# Altium project Hardware_Project.PrjPcb
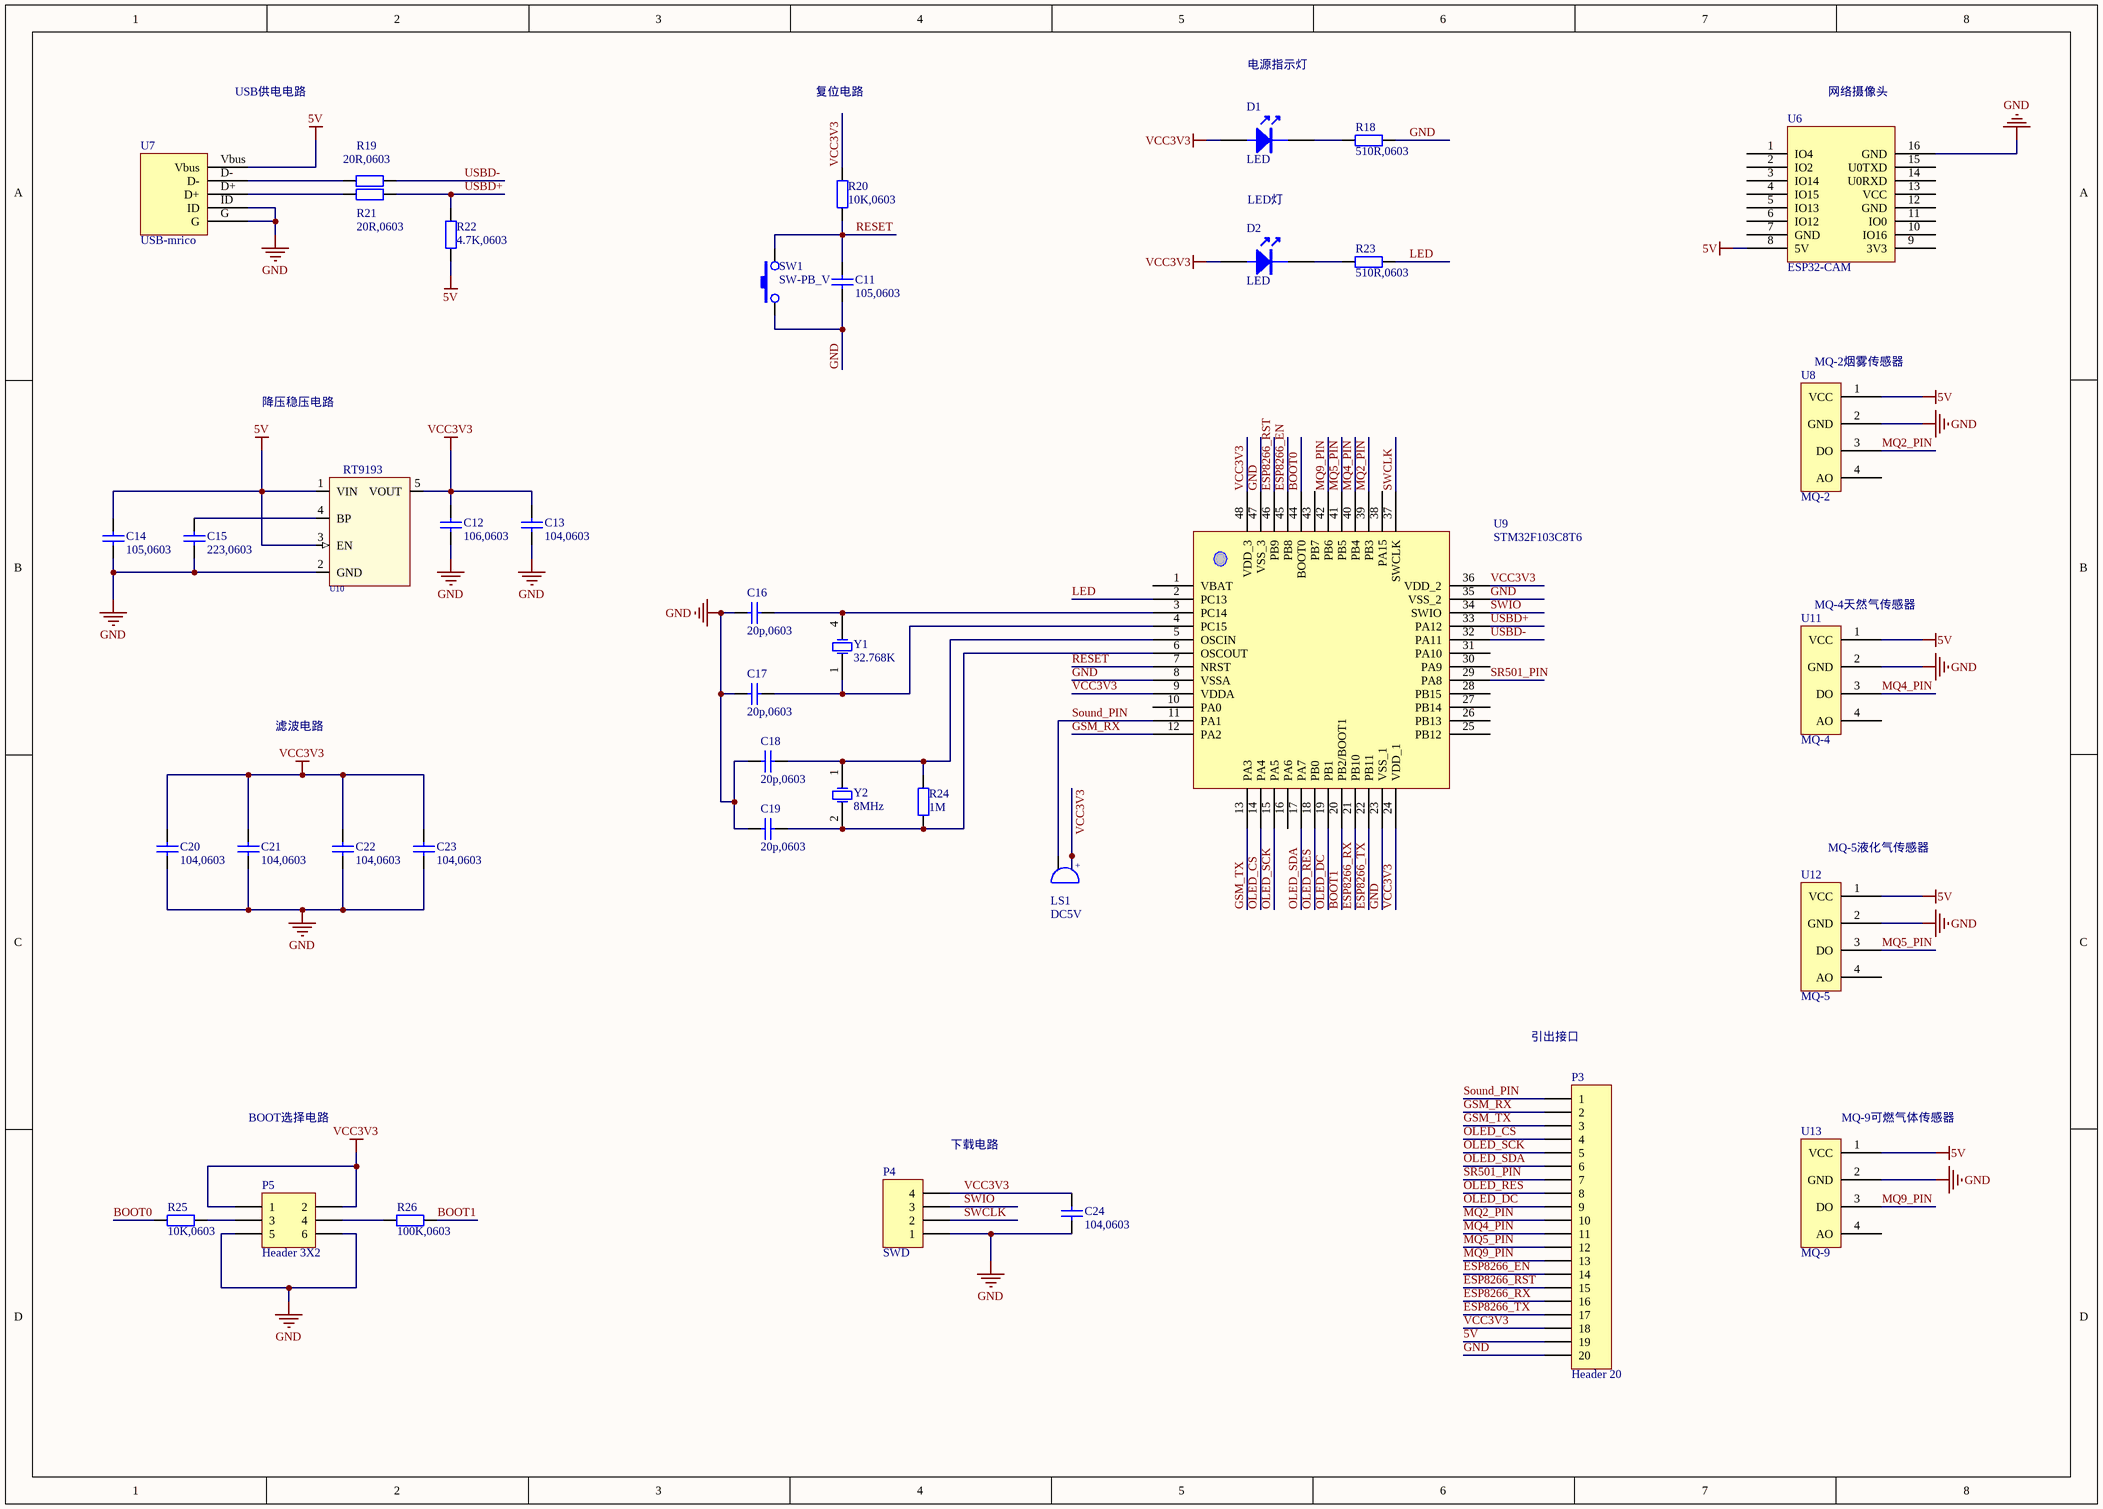
[diagram p0: STM32F103C8T6.SchDoc]
6 sheets, 149 parts. Net scope: global (net labels, ports and power ports of the same name join across sheets).
Sheets:
  STM32F103C8T6.SchDoc
  MQ.SchDoc
  SIM800A.SchDoc
  ESP-01S.SchDoc
  OLED.SchDoc
  HC-SR501.SchDoc

## Sheet STM32F103C8T6.SchDoc
size A3; SheetNumber: 1; SheetTotal: 6

### Parts
C11  105,0603  [C0603]
C12  106,0603  [C0603]
C13  104,0603  [C0603]
C14  105,0603  [C0603]
C15  223,0603  [C0603]
C16  20p,0603  [C0603]
C17  20p,0603  [C0603]
C18  20p,0603  [C0603]
C19  20p,0603  [C0603]
C20  104,0603  [C0603]
C21  104,0603  [C0603]
C22  104,0603  [C0603]
C23  104,0603  [C0603]
C24  104,0603  [C0603]
D1  LED  [LED]
D2  LED  [LED]
LS1  DC5V  [BEEP 5x9x5.5]
P3  Header 20  [HDR1X20]
P4  SWD  [HDR1X4]
P5  Header 3X2  [HDR2X3]
R18  510R,0603  [R0603]
R19  20R,0603  [R0603]
R20  10K,0603  [R0603]
R21  20R,0603  [R0603]
R22  4.7K,0603  [R0603]
R23  510R,0603  [R0603]
R24  1M  [R0603]
R25  10K,0603  [R0603]
R26  100K,0603  [R0603]
SW1  SW-PB_V  [KEY-SMT]
U6  ESP32-CAM
U7  USB-mrico  [Micro_USB]
U8  MQ-2
U9  STM32F103C8T6  [48P]
U10  RT9193  [SOT-23-5]
U11  MQ-4
U12  MQ-5
U13  MQ-9
Y1  32.768K  [X/2.5/2/6/2.5]
Y2  8MHz  [X/2.5/2/6/2.5]

### Nets
5V: C14.2 P3.19 R22.1 U6.8(5V) U7.Vbus U8.1(VCC) U10.1(VIN) U10.3(EN) U11.1(VCC) U12.1(VCC) U13.1(VCC)
GND: C11.1 C12.1 C13.1 C14.1 C15.1 C16.2 C17.2 C18.2 C19.2 C20.1 C21.1 C22.1 C23.1 C24.1 P3.20 P4.1 P5.5 P5.6 R18.2 SW1.1 U6.16(GND) U7.G U7.ID U8.2(GND) U9.8(VSSA) U9.23(VSS_1) U9.35(VSS_2) U9.47(VSS_3) U10.2(GND) U11.2(GND) U12.2(GND) U13.2(GND)
VCC3V3: C12.2 C13.2 C20.2 C21.2 C22.2 C23.2 C24.2 D1.A D2.A LS1.1 P3.18 P4.4 P5.1 P5.2 R20.2 U9.9(VDDA) U9.24(VDD_1) U9.36(VDD_2) U9.48(VDD_3) U10.5(VOUT)
BOOT0: R25.2 U9.44(BOOT0)
BOOT1: R26.1 U9.20(PB2/BOOT1)
ESP8266_EN: P3.14 U9.45(PB8)
ESP8266_RST: P3.15 U9.46(PB9)
ESP8266_RX: P3.16 U9.21(PB10)
ESP8266_TX: P3.17 U9.22(PB11)
GSM_RX: P3.2 U9.12(PA2)
GSM_TX: P3.3 U9.13(PA3)
LED: R23.2 U9.2(PC13)
MQ2_PIN: P3.10 U8.3(DO) U9.39(PB3)
MQ4_PIN: P3.11 U9.40(PB4) U11.3(DO)
MQ5_PIN: P3.12 U9.41(PB5) U12.3(DO)
MQ9_PIN: P3.13 U9.42(PB6) U13.3(DO)
OLED_CS: P3.4 U9.14(PA4)
OLED_DC: P3.9 U9.19(PB1)
OLED_RES: P3.8 U9.18(PB0)
OLED_SCK: P3.5 U9.15(PA5)
OLED_SDA: P3.6 U9.17(PA7)
RESET: C11.2 R20.1 SW1.2 U9.7(NRST)
Sound_PIN: LS1.2 P3.1 U9.11(PA1)
SR501_PIN: P3.7 U9.29(PA8)
SWCLK: P4.2 U9.37(SWCLK)
SWIO: P4.3 U9.34(SWIO)
USBD+: R21.1 R22.2 U9.33(PA12)
USBD-: R19.2 U9.32(PA11)
NetC15_2: C15.2 U10.4(BP)
NetC16_1: C16.1 U9.3(PC14) Y1.4(OSC2)
NetC17_1: C17.1 U9.4(PC15) Y1.1(OSC1)
NetC18_1: C18.1 R24.2 U9.5(OSCIN) Y2.1(OSC1)
NetC19_1: C19.1 R24.1 U9.6(OSCOUT) Y2.2(OSC2)
NetD1_K: D1.K R18.1
NetD2_K: D2.K R23.1
NetP5_3: P5.3 R25.1
NetP5_4: P5.4 R26.2
NetR19_1: R19.1 U7.D-
NetR21_2: R21.2 U7.D+

Not connected (* = marked no-connect by the designer): U6 1(IO4) 2(IO2) 3(IO14) 4(IO15) 5(IO13) 6(IO12) 7(GND) 9(3V3) 10(IO16) 11(IO0) 12(GND) 13(VCC) 14(U0RXD) 15(U0TXD); U8 4(AO); U9 1(VBAT) 10(PA0) 16(PA6) 25(PB12) 26(PB13) 27(PB14) 28(PB15) 30(PA9) 31(PA10) 38(PA15) 43(PB7); U11 4(AO); U12 4(AO); U13 4(AO)

### Notes on the sheet
- USB供电电路
- 复位电路
- 电源指示灯
- 网络摄像头
- LED灯
- (near U8) MQ-2烟雾传感器
- 降压稳压电路
- (near U11) MQ-4天然气传感器
- 滤波电路
- (near U12) MQ-5液化气传感器
- 引出接口
- BOOT选择电路
- (near U13) MQ-9可燃气体传感器
- (near P4) 下载电路
- (in symbol BEEP) +

### Library data of the parts
C11-C24 = Cap: Capacitor; Value: 104; Published: 8-Jun-2000; LatestRevisionDate: 17-Jul-2002; LatestRevisionNote: Re-released for DXP Platform.; Publisher: Altium Limited
D1 D2 = LED: pin to pad: A>1 K>2
LS1 = BEEP: 蜂鸣器; 联系下单店铺卖家 免费技术支持: 联系下单店铺卖家 免费帮你查找封装; BOM名称: 蜂鸣器
P3 = Header 20: Header, 20-Pin; LatestRevisionDate: 17-Jul-2002; LatestRevisionNote: Re-released for DXP Platform.; Publisher: Altium Limited
P4 = Header 4: Header, 4-Pin; LatestRevisionDate: 17-Jul-2002; LatestRevisionNote: Re-released for DXP Platform.; Publisher: Altium Limited
P5 = Header 3X2: Header, 3-Pin, Dual row; LatestRevisionDate: 17-Jul-2002; LatestRevisionNote: Re-released for DXP Platform.; Publisher: Altium Limited
R18-R26 = Res2: Resistor; Published: 8-Jun-2000; LatestRevisionDate: 17-Jul-2002; LatestRevisionNote: Re-released for DXP Platform.; Publisher: Altium Limited
SW1 = SW-PB_V: SWITCH
U7 = usb-STM
U10 = RT9193X_5P: ICA_MFR_NAME: RICHTEK; ICA_PARTNUM: $$2191094$$RT9193-15CU5; Part Number: TMP-13
Y1 Y2 = XTAL: Crystal Oscillator; Published: 8-Jun-2000; LatestRevisionDate: 17-Jul-2002; LatestRevisionNote: Re-released for DXP Platform.; Publisher: Altium Limited

## Sheet MQ.SchDoc
size A4; SheetNumber: 2; SheetTotal: 6
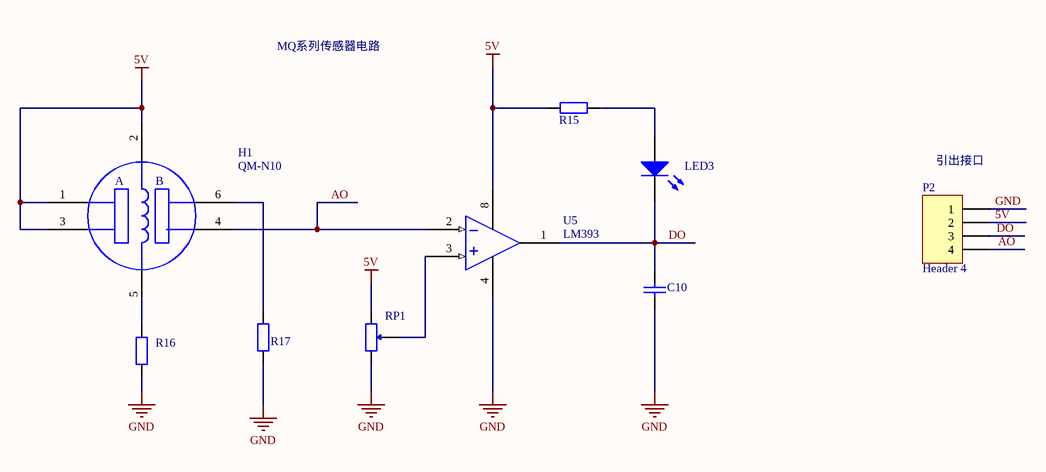
[diagram p1: MQ.SchDoc]

### Parts
C10  104  [C0805_L]  (value not drawn)
H1  QM-N10
LED3  红色  [LED0805_G]  (value not drawn)
P2  Header 4  [HDR1X4]
R15  1K  [R0805_L]  (value not drawn)
R16  1K  [R0805_L]  (value not drawn)
R17  1K  [R0805_L]  (value not drawn)
RP1  10K  [3303W]  (value not drawn)
U5  LM393

### Nets
5V: P2.2 R15.2 RP1.1
GND: C10.1 P2.1 R16.1 R17.1 RP1.3
AO: P2.4 U5.2
DO: C10.2 LED3.2(K) P2.3
NetLED3_1: LED3.1(A) R15.1
NetRP1_2: RP1.2 U5.3

Not connected (* = marked no-connect by the designer): H1 1 2 3 4(_) 5(_) 6(_); R16 2; R17 2; U5 1(_) 4(_) 8(_)

### Notes on the sheet
- MQ系列传感器电路
- (near P2) 引出接口
- (in symbol QM-N10) A; B

### Library data of the parts
C10 = C: 贴片电容/MLCC电容; BOM名称: 无极性贴片电容; 联系下单店铺卖家 免费帮你查找封装: 联系下单店铺卖家 免费技术支持
LED3 = LED: 贴片LED; 封装库来自淘宝卖家：黄晶宝石: 其他店铺购入均为盗版封装库，无更新权益，退款现金奖励200~1000元; BOM名称: 贴片LED
P2 = Header 4: Header, 4-Pin; LatestRevisionDate: 17-Jul-2002; LatestRevisionNote: Re-released for DXP Platform.; Publisher: Altium Limited
R15-R17 = R: 贴片电阻; 当前库版本V2022.10.7 @黄晶宝石: 最新版本发布https://shop463601444.taobao.com; BOM名称: 贴片电阻
RP1 = RP-SMD: 贴片电位器; 联系下单店铺卖家 免费帮你查找封装: 联系下单店铺卖家 免费技术支持; BOM名称: 贴片电位器

## Sheet SIM800A.SchDoc
size A4; SheetNumber: 3; SheetTotal: 6
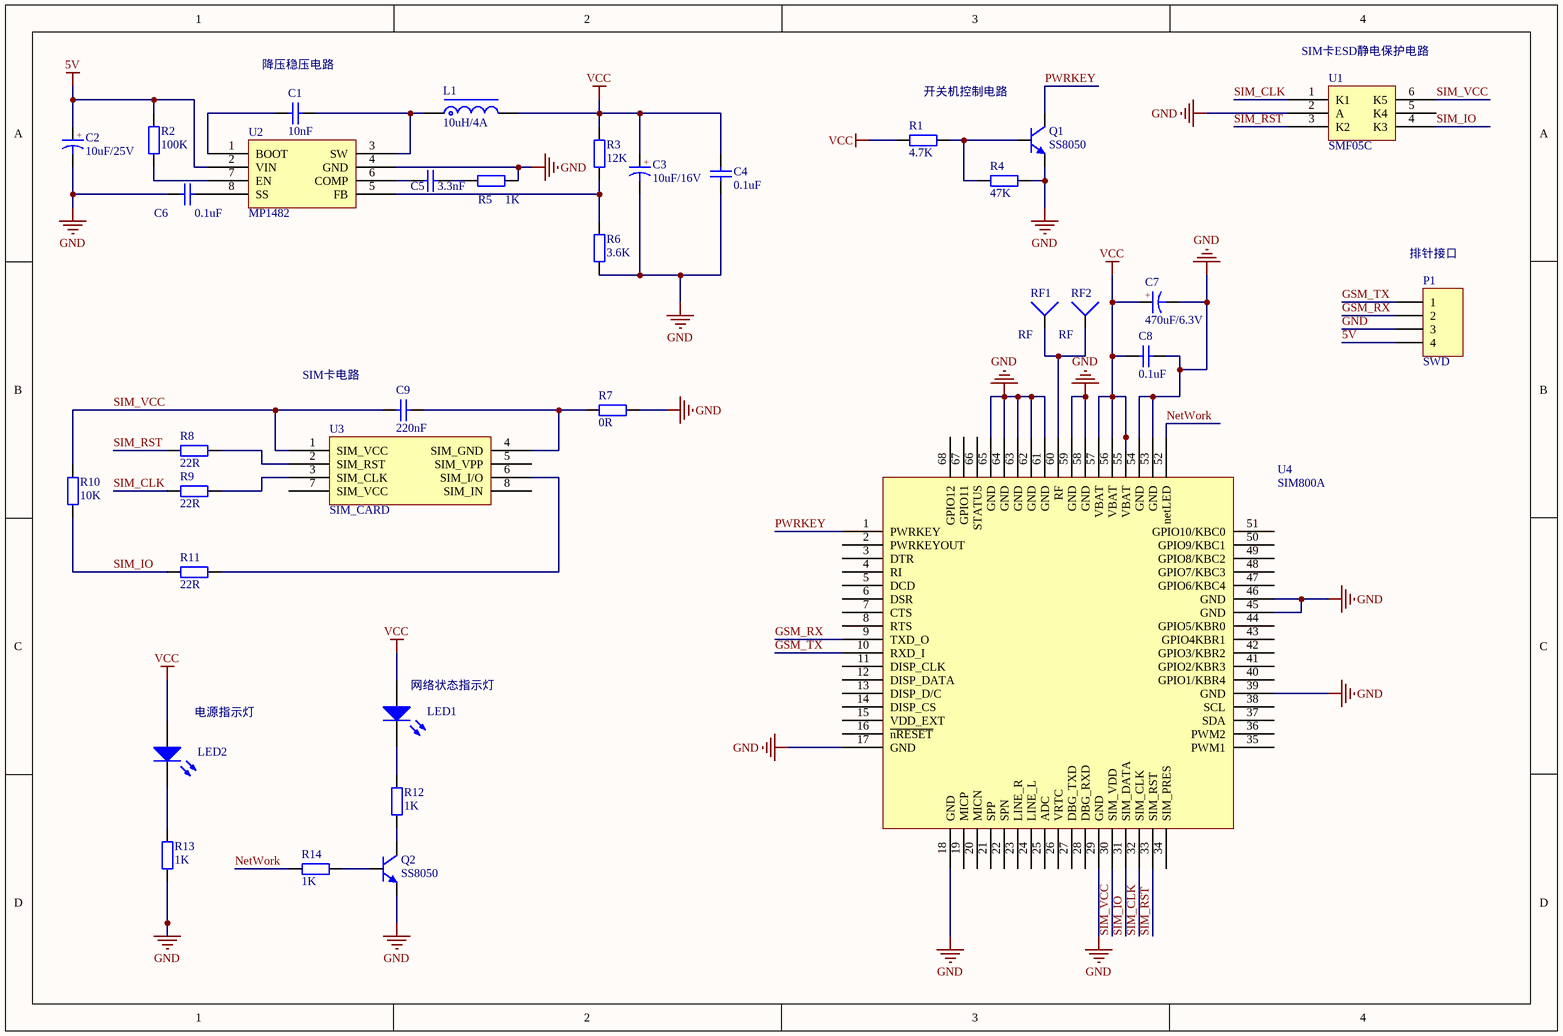
[diagram p2: SIM800A.SchDoc]

### Parts
C1  10nF  [C0805_L]
C2  10uF/25V  [CE-1.5*4*8]
C3  10uF/16V  [CE-1.5*4*8]
C4  0.1uF  [C0805_L]
C5  3.3nF  [C0805_L]
C6  0.1uF  [C0805_L]
C7  470uF/6.3V  [CE-1.5*4*8]
C8  0.1uF  [C0805_L]
C9  220nF  [C0805_L]
L1  10uH/4A  [LMR135]
LED1  红色  [LED0805_G]  (value not drawn)
LED2  红色  [LED0805_G]  (value not drawn)
P1  SWD  [HDR1X4]
Q1  SS8050  [TO92A]
Q2  SS8050  [TO92A]
R1  4.7K  [R0805_L]
R2  100K  [R0805_L]
R3  12K  [R0805_L]
R4  47K  [R0805_L]
R5  1K  [R0805_L]
R6  3.6K  [R0805_L]
R7  0R  [R0805_L]
R8  22R  [R0805_L]
R9  22R  [R0805_L]
R10  10K  [R0805_L]
R11  22R  [R0805_L]
R12  1K  [R0805_L]
R13  1K  [R0805_L]
R14  1K  [R0805_L]
RF1  RF
RF2  RF
U1  SMF05C
U2  MP1482
U3  SIM_CARD
U4  SIM800A

### Nets
5V: C2.1 P1.4 R2.2 U2.2(VIN)
GND: C2.2 C3.2 C4.1 C6.1 C7.2 C8.2 P1.3 Q1.1(E) Q2.1(E) R4.1 R5.2 R6.1 R7.1 R13.1 U1.2(A) U2.4(GND) U4.17(GND) U4.18(GND) U4.29(GND) U4.39(GND) U4.45(GND) U4.46(GND) U4.53(GND) U4.54(GND) U4.58(GND) U4.59(GND) U4.61(GND) U4.62(GND) U4.63(GND) U4.64(GND) U4.65(GND)
VCC: C3.1 C4.2 C7.1 C8.1 L1.2 LED1.1(A) LED2.1(A) R1.2 R3.2 U4.55(VBAT) U4.56(VBAT) U4.57(VBAT)
GSM_RX: P1.2 U4.9(TXD_O)
GSM_TX: P1.1 U4.10(RXD_I)
NetWork: R14.2 U4.52(netLED)
PWRKEY: Q1.3(C) U4.1(PWRKEY)
SIM_CLK: R9.2 U1.1(K1) U4.32(SIM_CLK)
SIM_IO: R10.2 R11.2 U1.4(K3) U4.31(SIM_DATA)
SIM_RST: R8.2 U1.3(K2) U4.33(SIM_RST)
SIM_VCC: C9.2 R10.1 U1.6(K5) U3.1(SIM_VCC) U4.30(SIM_VDD)
NetC1_1: C1.1 U2.1(BOOT)
NetC1_2: C1.2 L1.1 U2.3(SW)
NetC5_1: C5.1 U2.6(COMP)
NetC5_2: C5.2 R5.1
NetC6_2: C6.2 U2.8(SS)
NetC9_1: C9.1 R7.2 U3.4(SIM_GND)
NetLED1_2: LED1.2(K) R12.2
NetLED2_2: LED2.2(K) R13.2
NetQ1_2: Q1.2(B) R1.1 R4.2
NetQ2_2: Q2.2(B) R14.1
NetQ2_3: Q2.3(C) R12.1
NetR2_1: R2.1 U2.7(EN)
NetR3_1: R3.1 R6.2 U2.5(FB)
NetR8_1: R8.1 U3.2(SIM_RST)
NetR9_1: R9.1 U3.3(SIM_CLK)
NetR11_1: R11.1 U3.6(SIM_I/O)

Not connected (* = marked no-connect by the designer): U1 5(K4); U3 5(SIM_VPP) 7(SIM_VCC) 8(SIM_IN); U4 2(PWRKEYOUT) 3(DTR) 4(RI) 5(DCD) 6(DSR) 7(CTS) 8(RTS) 11(DISP_CLK) 12(DISP_DATA) 13(DISP_D/C) 14(DISP_CS) 15(VDD_EXT) 16(~{nRESET}) 19(MICP) 20(MICN) 21(SPP) 22(SPN) 23(LINE_R) 24(LINE_L) 25(ADC) 26(VRTC) 27(DBG_TXD) 28(DBG_RXD) 34(SIM_PRES) 35(PWM1) 36(PWM2) 37(SDA) 38(SCL) 40(GPIO1/KBR4) 41(GPIO2/KBR3) 42(GPIO3/KBR2) 43(GPIO4KBR1) 44(GPIO5/KBR0) 47(GPIO6/KBC4) 48(GPIO7/KBC3) 49(GPIO8/KBC2) 50(GPIO9/KBC1) 51(GPIO10/KBC0) 60(RF) 66(STATUS) 67(GPIO11) 68(GPIO12)

### Notes on the sheet
- (near C1) 降压稳压电路
- (near R1) 开关机控制电路
- (near U1) SIM卡ESD静电保护电路
- (near P1) 排针接口
- SIM卡电路
- (near LED2) 电源指示灯
- (near LED1) 网络状态指示灯
- (in symbol CE) +

### Library data of the parts
C1 C4-C6 C8 C9 = C: as C10 on sheet MQ
C2 C3 C7 = CE: 直插电解电容; 联系下单店铺卖家 免费帮你查找封装: 联系下单店铺卖家 免费技术支持; BOM名称: 直插电解电容
L1 = L-MR: 功率磁环电感; 联系下单店铺卖家 免费帮你查找封装: 联系下单店铺卖家 免费技术支持; BOM名称: 功率磁环电感
LED1 LED2 = LED: as LED3 on sheet MQ; BOM名称: 贴片LED
P1 = Header 4: Header, 4-Pin; LatestRevisionDate: 17-Jul-2002; LatestRevisionNote: Re-released for DXP Platform.; Publisher: Altium Limited
Q1 Q2 = 8050-DIP: 高频放大-NPN型; 参数: 40V 1.5A 1W 100MHZ; 联系下单店铺卖家 免费帮你查找封装: 联系下单店铺卖家 免费技术支持; BOM名称: 高频放大-NPN型
R1-R14 = R: as R15 on sheet MQ; BOM名称: 贴片电阻

## Sheet ESP-01S.SchDoc
size A4; SheetNumber: 4; SheetTotal: 6
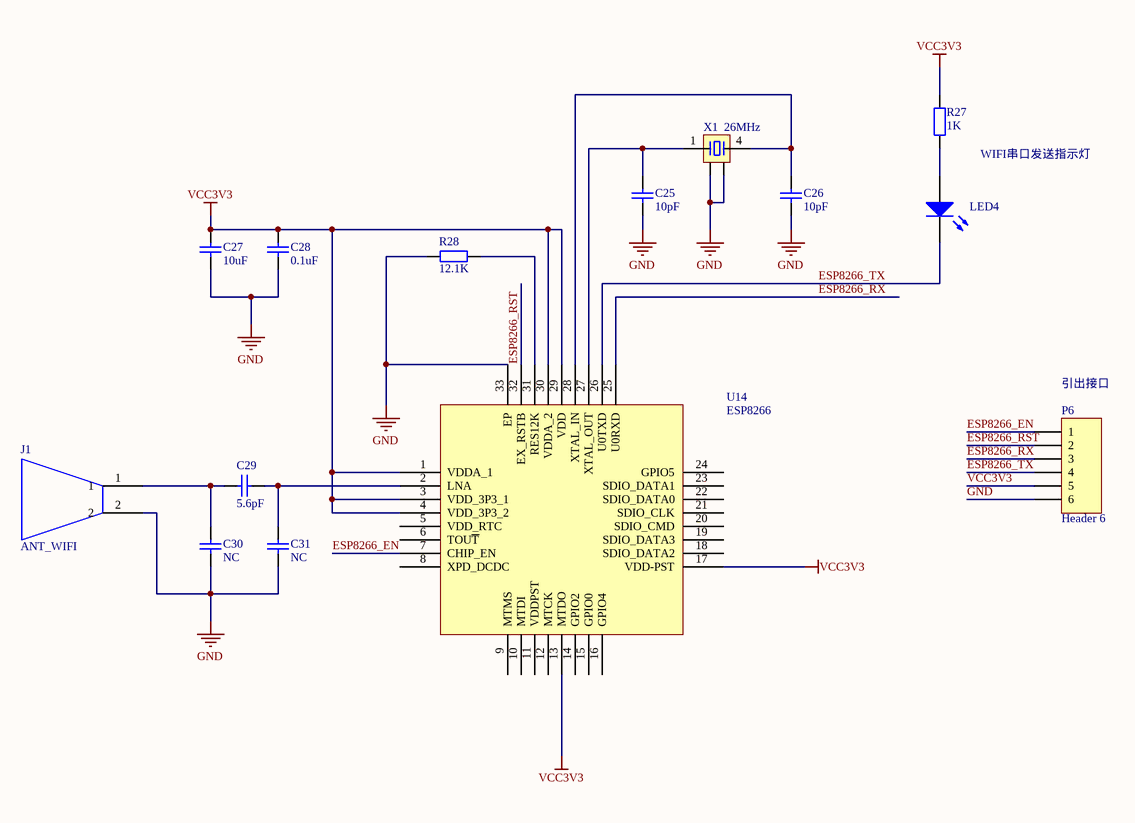
[diagram p3: ESP-01S.SchDoc]

### Parts
C25  10pF  [C0805_L]
C26  10pF  [C0805_L]
C27  10uF  [C0805_L]
C28  0.1uF  [C0805_L]
C29  5.6pF  [C0805_L]
C30  NC  [C0805_L]
C31  NC  [C0805_L]
J1  ANT_WIFI
LED4  红色  [LED0805_G]  (value not drawn)
P6  Header 6  [HDR1X6]
R27  1K  [R0805_L]
R28  12.1K  [R0805_L]
U14  ESP8266
X1  26MHz  [MC-146]

### Nets
GND: C25.1 C26.1 C27.1 C28.1 C30.1 C31.1 J1.2 P6.6 R28.1 U14.33(EP) X1.2 X1.3
VCC3V3: C27.2 C28.2 P6.5 R27.2 U14.1(VDDA_1) U14.3(VDD_3P3_1) U14.4(VDD_3P3_2) U14.13(MTDO) U14.17(VDD-PST) U14.29(VDD) U14.30(VDDA_2)
ESP8266_EN: P6.1 U14.7(CHIP_EN)
ESP8266_RST: P6.2 U14.32(EX_RSTB)
ESP8266_RX: P6.3 U14.25(U0RXD)
ESP8266_TX: LED4.2(K) P6.4 U14.26(U0TXD)
NetC25_2: C25.2 U14.27(XTAL_OUT) X1.1
NetC26_2: C26.2 U14.28(XTAL_IN) X1.4
NetC29_1: C29.1 C31.2 U14.2(LNA)
NetC29_2: C29.2 C30.2 J1.1
NetLED4_1: LED4.1(A) R27.1
NetR28_2: R28.2 U14.31(RES12K)

Not connected (* = marked no-connect by the designer): U14 5(VDD_RTC) 6(TOU~{T}) 8(XPD_DCDC) 9(MTMS) 10(MTDI) 11(VDDPST) 12(MTCK) 14(GPIO2) 15(GPIO0) 16(GPIO4) 18(SDIO_DATA2) 19(SDIO_DATA3) 20(SDIO_CMD) 21(SDIO_CLK) 22(SDIO_DATA0) 23(SDIO_DATA1) 24(GPIO5)

### Notes on the sheet
- WIFI串口发送指示灯
- (near P6) 引出接口

### Library data of the parts
C25-C31 = C: as C10 on sheet MQ
LED4 = LED: as LED3 on sheet MQ; BOM名称: 贴片LED
P6 = Header 6: Header, 6-Pin; LatestRevisionDate: 17-Jul-2002; LatestRevisionNote: Re-released for DXP Platform.; Publisher: Altium Limited
R27 R28 = R: as R15 on sheet MQ; BOM名称: 贴片电阻
X1 = XTAL-MC-4P: MC系列4脚无源晶振(谐振器）; 当前库版本V2022.10.7 @黄晶宝石: 最新版本发布https://shop463601444.taobao.com; BOM名称: MC系列4脚无源晶振(谐振器）

## Sheet OLED.SchDoc
size A4; SheetNumber: 5; SheetTotal: 6
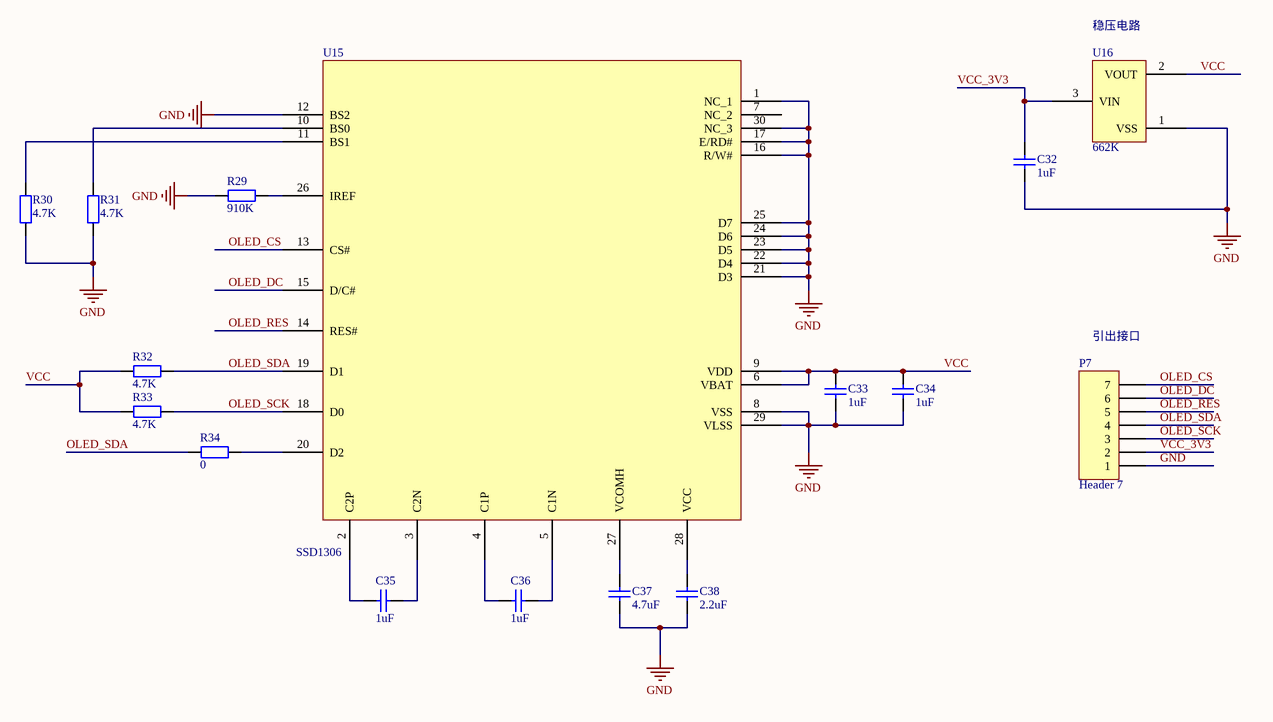
[diagram p4: OLED.SchDoc]

### Parts
C32  1uF  [C0805_L]
C33  1uF  [C0805_L]
C34  1uF  [C0805_L]
C35  1uF  [C0805_L]
C36  1uF  [C0805_L]
C37  4.7uF  [C0805_L]
C38  2.2uF  [C0805_L]
P7  Header 7  [HDR1X7]
R29  910K  [R0805_L]
R30  4.7K  [R0805_L]
R31  4.7K  [R0805_L]
R32  4.7K  [R0805_L]
R33  4.7K  [R0805_L]
R34  0  [R0805_L]
U15  SSD1306
U16  662K

### Nets
GND: C32.1 C33.2 C34.2 C37.2 C38.2 P7.1 R29.2 R30.1 R31.1 U15.1(NC_1) U15.8(VSS) U15.12(BS2) U15.16(R/W#) U15.17(E/RD#) U15.21(D3) U15.22(D4) U15.23(D5) U15.24(D6) U15.25(D7) U15.29(VLSS) U15.30(NC_3) U16.1(VSS)
VCC: C33.1 C34.1 R32.2 R33.2 U15.6(VBAT) U15.9(VDD) U16.2(VOUT)
OLED_CS: P7.7 U15.13(CS#)
OLED_DC: P7.6 U15.15(D/C#)
OLED_RES: P7.5 U15.14(RES#)
OLED_SCK: P7.3 R33.1 U15.18(D0)
OLED_SDA: P7.4 R32.1 R34.1 U15.19(D1)
VCC_3V3: C32.2 P7.2 U16.3(VIN)
NetC35_1: C35.1 U15.3(C2N)
NetC35_2: C35.2 U15.2(C2P)
NetC36_1: C36.1 U15.5(C1N)
NetC36_2: C36.2 U15.4(C1P)
NetC37_1: C37.1 U15.27(VCOMH)
NetC38_1: C38.1 U15.28(VCC)
NetR29_1: R29.1 U15.26(IREF)
NetR30_2: R30.2 U15.11(BS1)
NetR31_2: R31.2 U15.10(BS0)
NetR34_2: R34.2 U15.20(D2)

Not connected (* = marked no-connect by the designer): U15 7(NC_2)

### Notes on the sheet
- (near U16) 稳压电路
- (near P7) 引出接口

### Library data of the parts
C32-C38 = C: as C10 on sheet MQ
P7 = Header 7: Header, 7-Pin; LatestRevisionDate: 17-Jul-2002; LatestRevisionNote: Re-released for DXP Platform.; Publisher: Altium Limited
R29-R34 = R: as R15 on sheet MQ; BOM名称: 贴片电阻

## Sheet HC-SR501.SchDoc
size A3; SheetNumber: 6; SheetTotal: 6
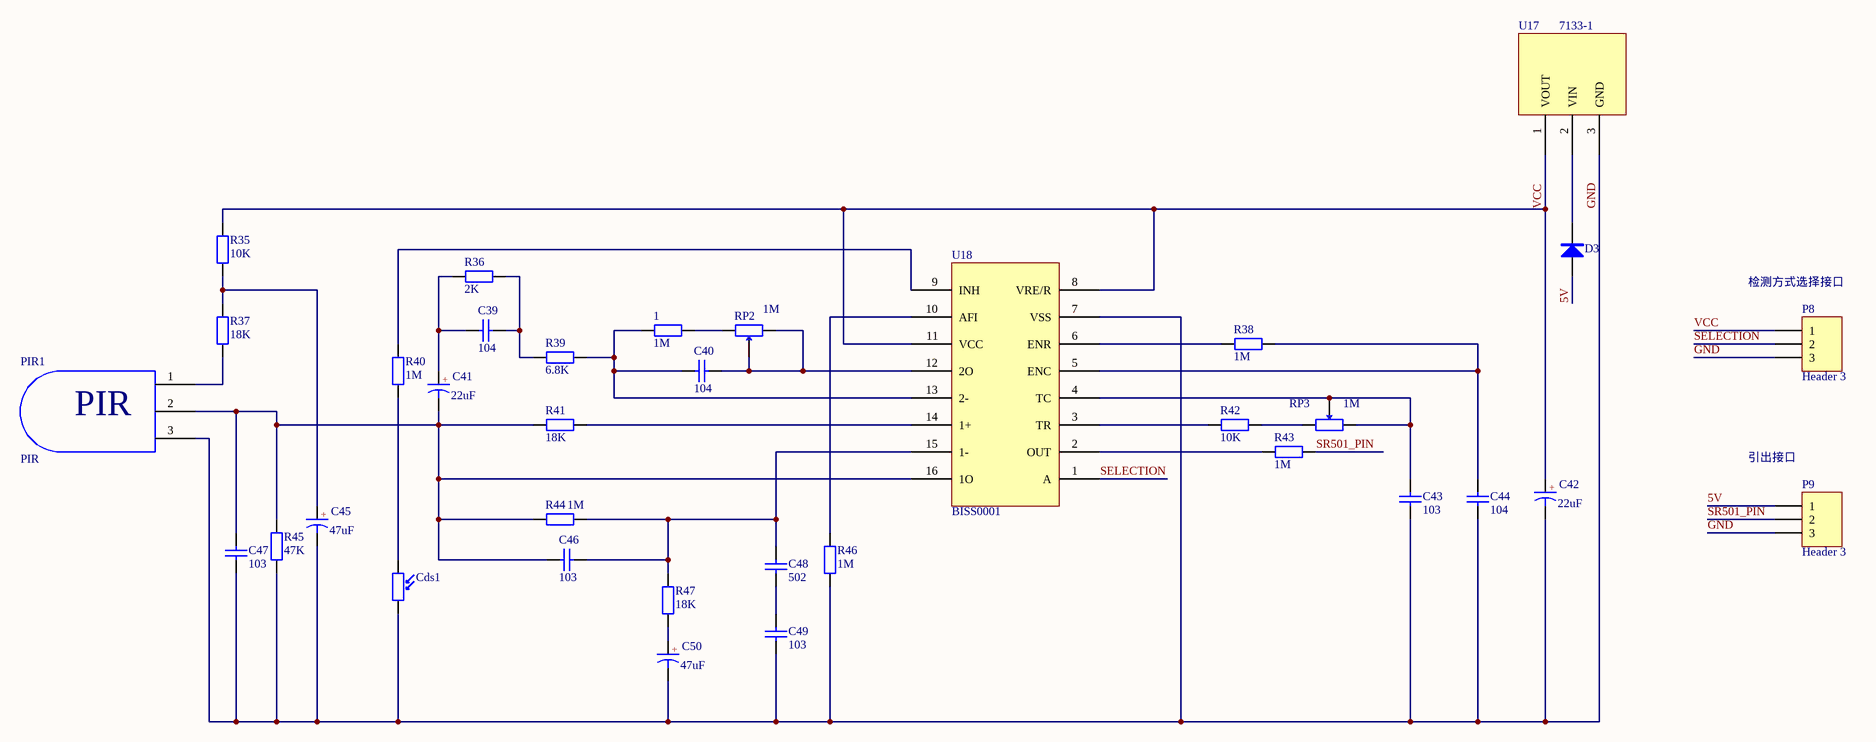
[diagram p5: HC-SR501.SchDoc]

### Parts
1  1M  [R0805_L]
C39  104  [C0805_L]
C40  104  [C0805_L]
C41  22uF  [CE-1.5*4*8]
C42  22uF  [CE-1.5*4*8]
C43  103  [C0805_L]
C44  104  [C0805_L]
C45  47uF  [CE-1.5*4*8]
C46  103  [C0805_L]
C47  103  [C0805_L]
C48  502  [C0805_L]
C49  103  [C0805_L]
C50  47uF  [CE-1.5*4*8]
Cds1  10K  [RG5528]  (value not drawn)
D3  M7  [SMA]  (value not drawn)
P8  Header 3  [HDR1X3]
P9  Header 3  [HDR1X3]
PIR1  PIR
R35  10K  [R0805_L]
R36  2K  [R0805_L]
R37  18K  [R0805_L]
R38  1M  [R0805_L]
R39  6.8K  [R0805_L]
R40  1M  [R0805_L]
R41  18K  [R0805_L]
R42  10K  [R0805_L]
R43  1M  [R0805_L]
R44  1M  [R0805_L]
R45  47K  [R0805_L]
R46  1M  [R0805_L]
R47  18K  [R0805_L]
RP2  1M  [3296W]
RP3  1M  [3296W]
U17  7133-1
U18  BISS0001

### Nets
5V: D3.1(A) P9.1
GND: C42.2 C43.2 C44.2 C45.2 C47.1 C49.2 C50.2 Cds1.2 P8.3 P9.3 PIR1.3 R45.1 R46.1 U17.3(GND) U18.7(VSS)
VCC: C42.1 P8.1 R35.2 U17.1(VOUT) U18.8(VRE/R) U18.11(VCC)
SELECTION: P8.2 U18.1(A)
SR501_PIN: P9.2 R43.1
Net1_1: 1.1 RP2.3
Net1_2: 1.2 C40.2 R39.1 U18.13(2-)
NetC39_1: C39.1 R36.1 R39.2
NetC39_2: C39.2 C41.1 R36.2
NetC40_1: C40.1 RP2.1 RP2.2 U18.12(2O)
NetC41_2: C41.2 C46.2 C47.2 PIR1.2 R41.2 R44.2 R45.2 U18.16(1O)
NetC43_1: C43.1 RP3.2 RP3.3 U18.4(TC)
NetC44_1: C44.1 R38.1 U18.5(ENC)
NetC45_1: C45.1 R35.1 R37.2
NetC46_1: C46.1 C48.1 R44.1 R47.1 U18.15(1-)
NetC48_2: C48.2 C49.1
NetC50_1: C50.1 R47.2
NetCds1_1: Cds1.1 R40.1
NetD3_2: D3.2(K) U17.2(VIN)
NetPIR1_1: PIR1.1(VIN) R37.1
NetR38_2: R38.2 U18.6(ENR)
NetR40_2: R40.2 U18.9(INH)
NetR41_1: R41.1 U18.14(1+)
NetR42_1: R42.1 RP3.1
NetR42_2: R42.2 U18.3(TR)
NetR43_2: R43.2 U18.2(OUT)
NetR46_2: R46.2 U18.10(AFI)

### Notes on the sheet
- (near P8) 检测方式选择接口
- (near P9) 引出接口
- (in symbol CE) +

### Library data of the parts
1 R35-R47 = R: as R15 on sheet MQ; BOM名称: 贴片电阻
C39 C40 C43 C44 C46-C49 = C: as C10 on sheet MQ
C41 C42 C45 C50 = CE: as C2 on sheet SIM800A; BOM名称: 直插电解电容
Cds1 = RG5516: 光敏电阻; 联系下单店铺卖家 免费帮你查找封装: 联系下单店铺卖家 免费技术支持; BOM名称: 光敏电阻
D3 = M7: 整流二极管; 当前库版本V2022.10.7 @淘宝卖家:黄晶宝石: 最新版本发布https://shop463601444.taobao.com; BOM名称: 整流二极管
P8 P9 = Header 3: Header, 3-Pin; LatestRevisionDate: 17-Jul-2002; LatestRevisionNote: Re-released for DXP Platform.; Publisher: Altium Limited
PIR1 = PIR: 热释电传感器
RP2 RP3 = RP: 单联电位器; BOM名称: 插件电位器; 联系下单店铺卖家 免费帮你查找封装: 联系下单店铺卖家 免费技术支持
U17 = 7133-1: 稳压芯片
U18 = BISS0001: 传感信号处理集成电路

## Nets that join several sheets
5V: STM32F103C8T6 (11 pins), MQ (P2.2 R15.2 RP1.1), SIM800A (C2.1 P1.4 R2.2 U2.2), HC-SR501 (D3.1 P9.1)
GND: STM32F103C8T6 (32 pins), MQ (5 pins), SIM800A (31 pins), ESP-01S (12 pins), OLED (22 pins), HC-SR501 (15 pins)
VCC: SIM800A (12 pins), OLED (7 pins), HC-SR501 (6 pins)
VCC3V3: STM32F103C8T6 (20 pins), ESP-01S (11 pins)
ESP8266_EN: STM32F103C8T6 (P3.14 U9.45), ESP-01S (P6.1 U14.7)
ESP8266_RST: STM32F103C8T6 (P3.15 U9.46), ESP-01S (P6.2 U14.32)
ESP8266_RX: STM32F103C8T6 (P3.16 U9.21), ESP-01S (P6.3 U14.25)
ESP8266_TX: STM32F103C8T6 (P3.17 U9.22), ESP-01S (LED4.2 P6.4 U14.26)
GSM_RX: STM32F103C8T6 (P3.2 U9.12), SIM800A (P1.2 U4.9)
GSM_TX: STM32F103C8T6 (P3.3 U9.13), SIM800A (P1.1 U4.10)
OLED_CS: STM32F103C8T6 (P3.4 U9.14), OLED (P7.7 U15.13)
OLED_DC: STM32F103C8T6 (P3.9 U9.19), OLED (P7.6 U15.15)
OLED_RES: STM32F103C8T6 (P3.8 U9.18), OLED (P7.5 U15.14)
OLED_SCK: STM32F103C8T6 (P3.5 U9.15), OLED (P7.3 R33.1 U15.18)
OLED_SDA: STM32F103C8T6 (P3.6 U9.17), OLED (P7.4 R32.1 R34.1 U15.19)
SR501_PIN: STM32F103C8T6 (P3.7 U9.29), HC-SR501 (P9.2 R43.1)